# Altium schematic sheet 4_FPGA.SchDoc: AX301 Http://www.heijin.org
size OrCAD B; DocumentNumber: 4; SheetNumber: 4; SheetTotal: 7; PageSetup: Record=PageOptions|CenterHorizontal=True|CenterVertical=True|PrintScale=0.75|XCorrection=1.00|YCorrection=1.00|PrintKind=0|BorderSize=5000000|LeftOffset=0|BottomOffset=0|Orientation=2|PaperLength=1000|PaperWidth=1000|Scale=100|PaperSource=7|PrintQuality=-4|MediaType=1|DitherType=10|PrintScaleMode=1|PaperKind=A4|PaperIndex=9
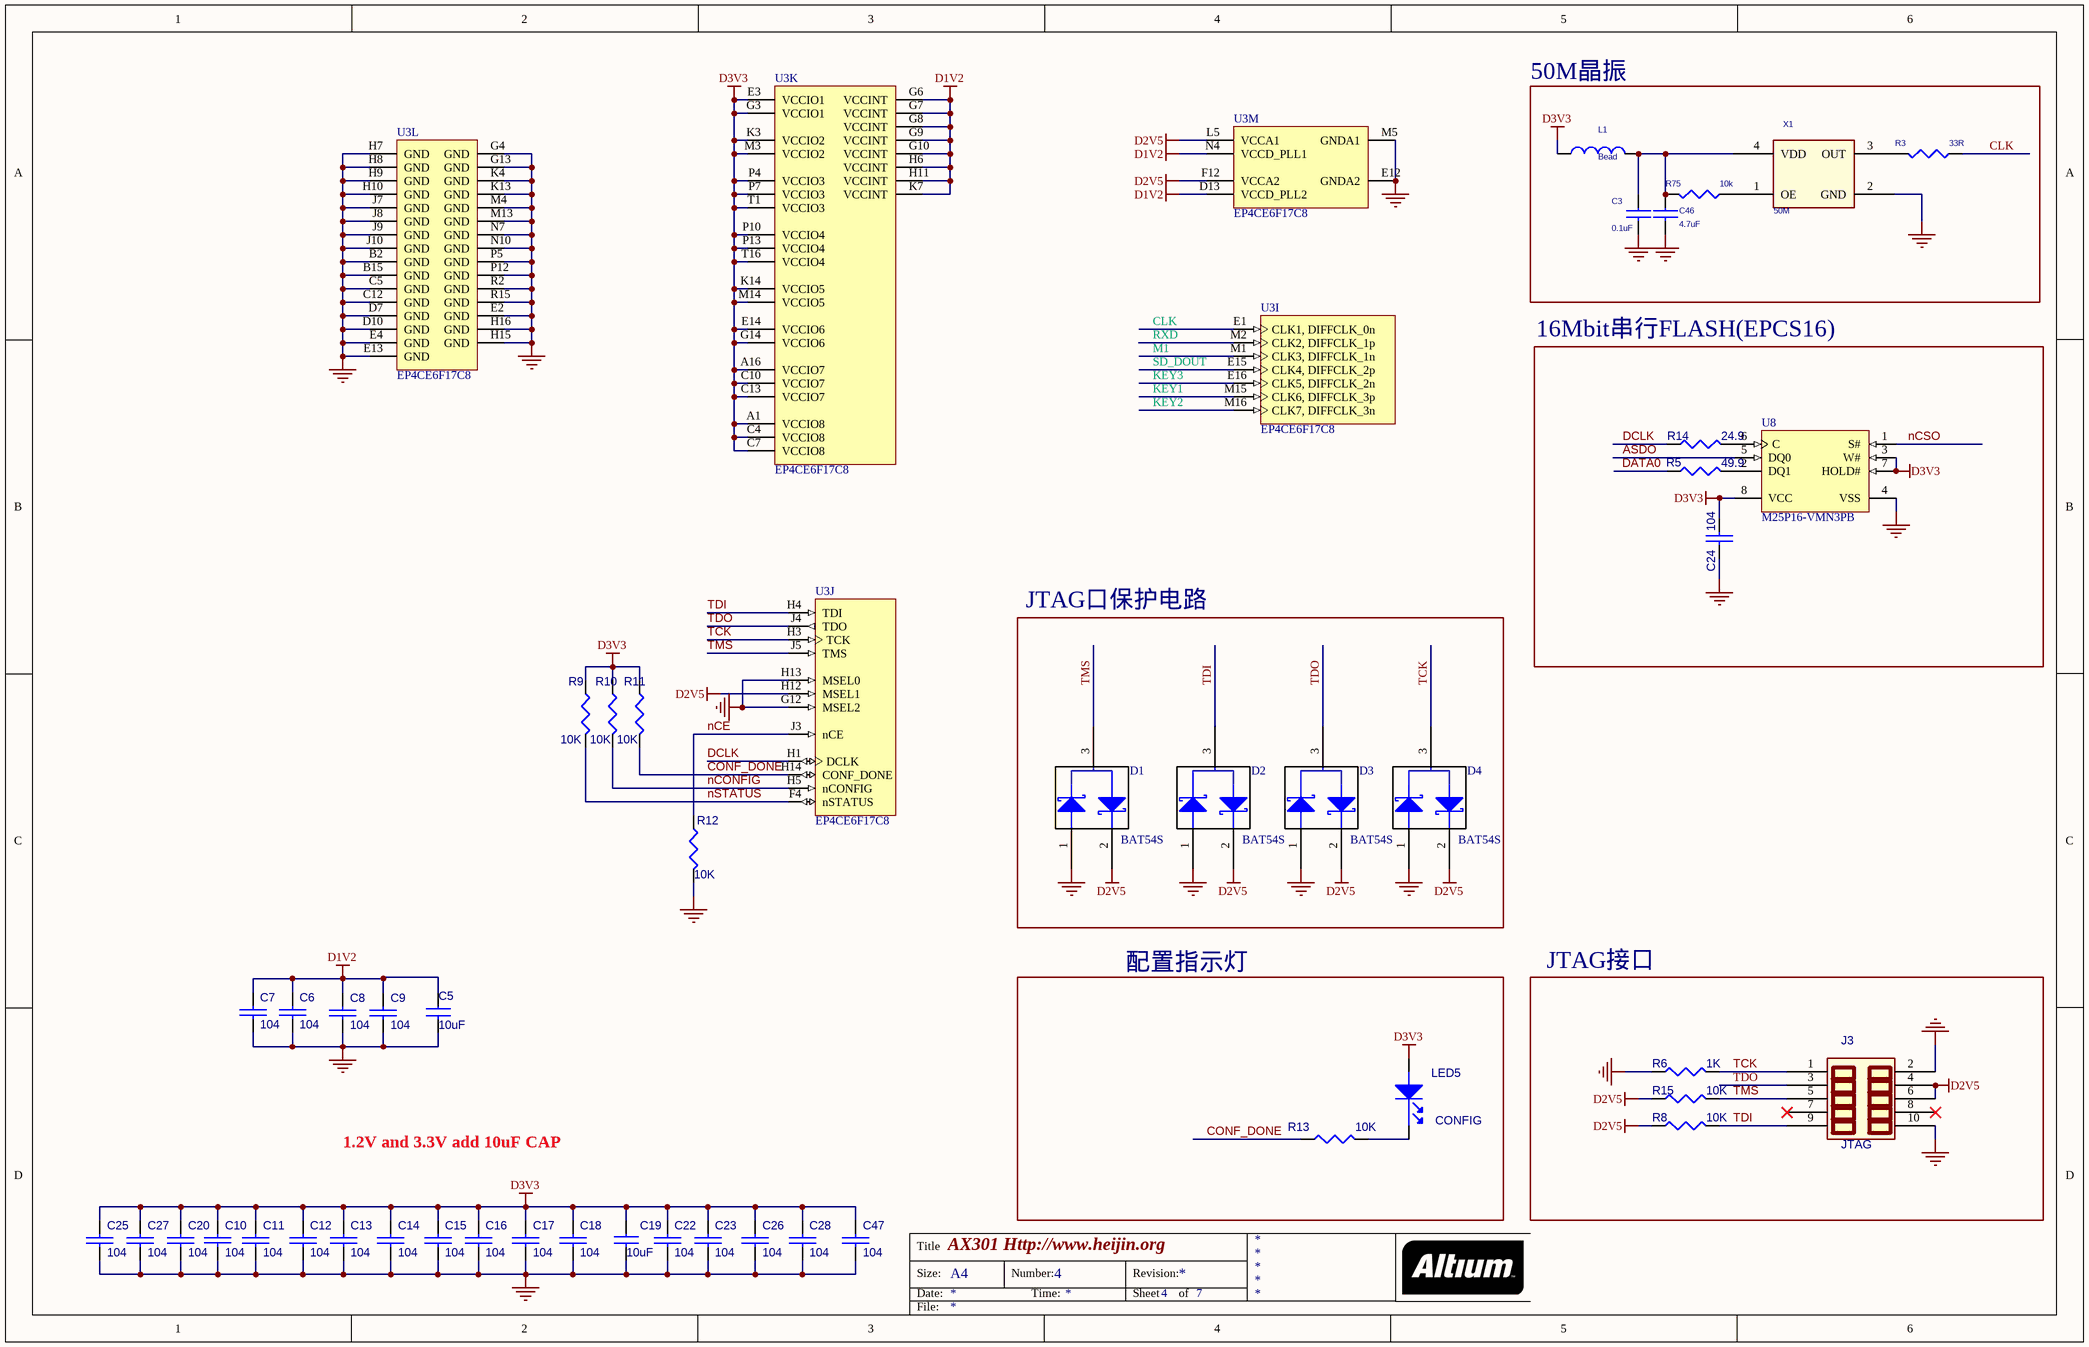
[diagram p0: 4_FPGA.SchDoc]

## Parts
C3  0.1uF  [0402]
C5  10uF  [0805]
C6  104  [0402]
C7  104  [0402]
C8  104  [0402]
C9  104  [0402]
C10  104  [0402]
C11  104  [0402]
C12  104  [0402]
C13  104  [0402]
C14  104  [0402]
C15  104  [0402]
C16  104  [0402]
C17  104  [0402]
C18  104  [0402]
C19  10uF  [0805]
C20  104  [0402]
C22  104  [0402]
C23  104  [0402]
C24  104  [0402]
C25  104  [0402]
C26  104  [0402]
C27  104  [0402]
C28  104  [0402]
C46  4.7uF  [0603]
C47  104  [0402]
D1  BAT54S  [SOT23]
D2  BAT54S  [SOT23]
D3  BAT54S  [SOT23]
D4  BAT54S  [SOT23]
J3  JTAG  [JTAG-10]
L1  Bead  [0603]
LED5  CONFIG  [LEDSO]
R3  33R  [0603]
R5  49.9  [0603]
R6  1K  [0603]
R8  10K  [0603]
R9  10K  [0603]
R10  10K  [0603]
R11  10K  [0603]
R12  10K  [0603]
R13  10K  [0603]
R14  24.9  [0603]
R15  10K  [0603]
R75  10k  [0603]
U3  EP4CE6F17C8  [FBGA256]  (parts I,J,K,L,M of 13)
U8  M25P16-VMN3PB  [SO8]
X1  50M  [CY_4]

## Blocks framed on the sheet
50M晶振: C3 C46 L1 R3 R75 X1
16Mbit串行FLASH(EPCS16): C24 R5 R14 U8
JTAG口保护电路: D1-D4
配置指示灯: LED5 R13
JTAG接口: J3 R6 R8 R15

## Nets
D1V2: C5.1 C6.1 C7.1 C8.1 C9.1 U3.D13(VCCD_PLL2) U3.G6(VCCINT) U3.G7(VCCINT) U3.G8(VCCINT) U3.G9(VCCINT) U3.G10(VCCINT) U3.H6(VCCINT) U3.H11(VCCINT) U3.K7(VCCINT) U3.N4(VCCD_PLL1)
D2V5: D1.2 D2.2 D3.2 D4.2 J3.4 J3.6 R8.1 R15.1 U3.F12(VCCA2) U3.H12(MSEL1) U3.L5(VCCA1)
D3V3: C10.1 C11.1 C12.1 C13.1 C14.1 C15.1 C16.1 C17.1 C18.1 C19.1 C20.1 C22.1 C23.1 C24.2 C25.1 C26.1 C27.1 C28.1 C47.1 L1.1 LED5.1(ANODE) R9.1 R10.1 R11.1 U3.A1(VCCIO8) U3.A16(VCCIO7) U3.C4(VCCIO8) U3.C7(VCCIO8) U3.C10(VCCIO7) U3.C13(VCCIO7) U3.E3(VCCIO1) U3.E14(VCCIO6) U3.G3(VCCIO1) U3.G14(VCCIO6) U3.K3(VCCIO2) U3.K14(VCCIO5) U3.M3(VCCIO2) U3.M14(VCCIO5) U3.P4(VCCIO3) U3.P7(VCCIO3) U3.P10(VCCIO4) U3.P13(VCCIO4) U3.T1(VCCIO3) U3.T16(VCCIO4) U8.3(W#) U8.7(HOLD#) U8.8(VCC)
GND: C3.2 C5.2 C6.2 C7.2 C8.2 C9.2 C10.2 C11.2 C12.2 C13.2 C14.2 C15.2 C16.2 C17.2 C18.2 C19.2 C20.2 C22.2 C23.2 C24.1 C25.2 C26.2 C27.2 C28.2 C46.2 C47.2 D1.1 D2.1 D3.1 D4.1 J3.2 J3.10 R6.1 R12.2 U3.B2(GND) U3.B15(GND) U3.C5(GND) U3.C12(GND) U3.D7(GND) U3.D10(GND) U3.E2(GND) U3.E4(GND) U3.E12(GNDA2) U3.E13(GND) U3.G4(GND) U3.G12(MSEL2) U3.G13(GND) U3.H7(GND) U3.H8(GND) U3.H9(GND) U3.H10(GND) U3.H13(MSEL0) U3.H15(GND) U3.H16(GND) U3.J7(GND) U3.J8(GND) U3.J9(GND) U3.J10(GND) U3.K4(GND) U3.K13(GND) U3.M4(GND) U3.M5(GNDA1) U3.M13(GND) U3.N7(GND) U3.N10(GND) U3.P5(GND) U3.P12(GND) U3.R2(GND) U3.R15(GND) U8.4(VSS) X1.2(GND)
ASDO: U8.5(DQ0)
CLK: R3.1 U3.E1(CLK1,_DIFFCLK_0n)
CONF_DONE: R11.2 R13.1 U3.H14(CONF_DONE)
DATA0: R5.1
DCLK: R14.1 U3.H1(DCLK)
KEY1: U3.M15(CLK6,_DIFFCLK_3p)
KEY2: U3.M16(CLK7,_DIFFCLK_3n)
KEY3: U3.E16(CLK5,_DIFFCLK_2n)
M1: U3.M1(CLK3,_DIFFCLK_1n)
nCE: R12.1 U3.J3(nCE)
nCONFIG: R10.2 U3.H5(nCONFIG)
nCSO: U8.1(S#)
nSTATUS: R9.2 U3.F4(nSTATUS)
RXD: U3.M2(CLK2,_DIFFCLK_1p)
SD_DOUT: U3.E15(CLK4,_DIFFCLK_2p)
TCK: D4.3 J3.1 R6.2 U3.H3(TCK)
TDI: D2.3 J3.9 R8.2 U3.H4(TDI)
TDO: D3.3 J3.3 U3.J4(TDO)
TMS: D1.3 J3.5 R15.2 U3.J5(TMS)
NetC3_1: C3.1 C46.1 L1.2 R75.2 X1.4(VDD)
NetLED5_2: LED5.2(CATHODE) R13.2
NetR3_2: R3.2 X1.3(OUT)
NetR5_2: R5.2 U8.2(DQ1)
NetR14_2: R14.2 U8.6(C)
NetR75_1: R75.1 X1.1(OE)

Not connected (* = marked no-connect by the designer): J3 7* 8*

## Notes on the sheet
- 1.2V and 3.3V add 10uF CAP
- Title
- Size:
- Date:
- A4
- Number:
- Time:
- Revision:
- Sheet
- of
- File:

## Library data of the parts
C3 C5 C19 C46 = CAP NP_Dup2
C6-C18 C20 C22-C28 C47 = C_Dup4
D1-D4 = BAV99
J3 = JTAG-10_Dup1
L1 = INDUCTOR
LED5 = LED_Dup1
R3 R75 = RESISTOR
R5 R9-R12 R14 = R_Dup3
R6 R8 R15 = R_Dup2
R13 = R_Dup1
U3 = EP4CE6F17C8: Cyclone IV Family FPGA, 2V Core, 179 I/O Pins, 2 PLLs, 256-Pin FBGA, Speed Grade 8, Commercial Grade; Published: 3-May-2010; DatasheetVersion: ver1.2, Mar-2010; PackageVersion: ver16.0, Dec-2009; PackageReference: FBGA256; Publisher: Altium Limited; PackageDescription: 256-Ball FineLine Ball Grid Array (FBGA256) - Option 1 - Wire Bond; Supplier 1: Digi-Key; Supplier Part Number 1: EP4CE6F17C8-ND; Code_JEDEC: MS-034-AAF-1; Code_IPC: BGA100P16X16-256; ComponentLink1Description: Manufacturer Link; ComponentLink1URL: http://www.altera.com/; ComponentLink2Description: Handbook; ComponentLink2URL: http://www.altera.com/literature/hb/cyclone-iv/cyclone4-handbook.pdf; ComponentLink3Description: Pinout Specification; ComponentLink3URL: http://www.altera.com/literature/lit-dp.jsp?category=cyc%204&showspreadsheet=y; ComponentLink4Description: Packaging Specification; ComponentLink4URL: http://www.altera.com/literature/ds/dspkg.pdf
U8 = M25P16-VMN3PB: 16 Mb (x1) Automotive Serial NOR Flash Memory, 75 MHz, 2.7 to 3.6 V, 8-pin SO8 Narrow (MN), Tube; Part Family: M25P爘ISHIDDEN=T; Manufacturer: Micron; Density: 16Mb爘ISHIDDEN=T; Speed: 75 MHz爘ISHIDDEN=T; Voltage: 2.7V-3.6V爘ISHIDDEN=T; DatasheetVersion: Rev. Y; PackageVersion: Rev 11; PackageReference: MICT-MN-8; PackageDescription: 8-Pin SO Narrow, 3.9 X 4.9 mm, Pitch 1.27 mm; Applications: Automotive爘ISHIDDEN=T; Package: SO8 Narrow爘ISHIDDEN=T; Part Status: Production爘ISHIDDEN=T; RoHS: Yes爘ISHIDDEN=T; Type: Data Storage爘ISHIDDEN=T; Width: x1爘ISHIDDEN=T; Mounting Technology: Surface Mount; PartNumber: M25P16-VMN3PB; ComponentLink1Description: Manufacturer URL; ComponentLink1URL: http://www.micron.com/; ComponentLink2Description: Datasheet; ComponentLink2URL: http://www.micron.com/~/media/Documents/Products/Data%20Sheet/NOR%20Flash/Serial%20NOR/M25P/M25P16.pdf; ComponentLink3Description: Package Specification; ComponentLink3URL: http://www.micron.com/~/media/Documents/Products/Data%20Sheet/NOR%20Flash/Serial%20NOR/M25P/M25P05A.pdf
X1 = OSC